# EAGLE schematic AS5040 (EAGLE 6.3)
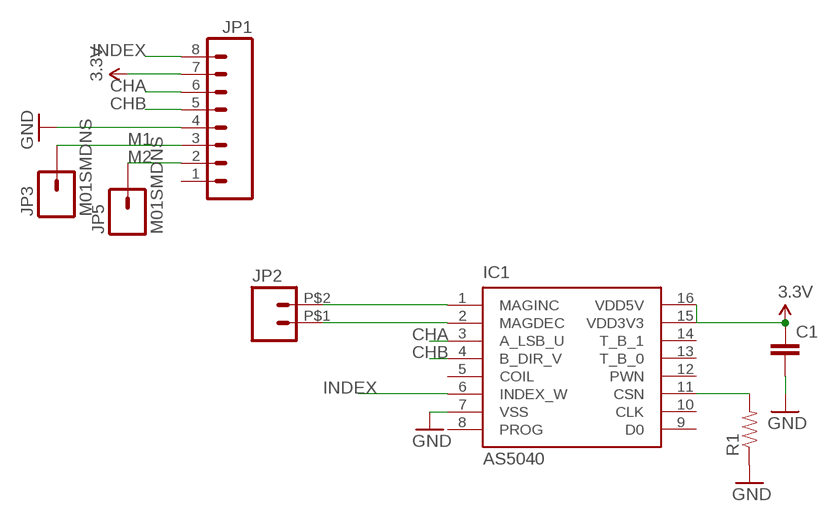
[diagram p0: schematic, sheet 1]

## Parts
C1  CAP0603-CAP  [0603-CAP]
IC1  AS5040  [SSOP16]
JP1  M08  [BM08B]
JP2  M02  [1X2SMD]
JP3  M01SMDNS  [1X01NS]
JP5  M01SMDNS  [1X01NS]
R1  RESISTOR0603-RES  [0603-RES]

## Nets
3.3V: C1.1 IC1.15(VDD3V3) IC1.16(VDD5V) JP1.7
CHA: IC1.3(A_LSB_U) JP1.6
CHB: IC1.4(B_DIR_V) JP1.5
GND: C1.2 IC1.7(VSS) JP1.4 R1.1
INDEX: IC1.6(INDEX_W) JP1.8
M1: JP1.3 JP3.1
M2: JP1.2 JP5.1
N$3: IC1.11(CSN) R1.2
N$4: IC1.1(MAGINC) JP2.P$2
N$5: IC1.2(MAGDEC) JP2.P$1
Unconnected: IC1.5(COIL) IC1.8(PROG) IC1.9(D0) IC1.10(CLK) IC1.12(PWN) IC1.13(T_B_0) IC1.14(T_B_1) JP1.1

## Library data of the parts
C1 = SparkFun-Passives:CAP: Capacitor Standard 0603 ceramic capacitor, and 0.1" leaded capacitor.
IC1 = austriamicrosystems:AS5040: 10-BIT PROGRAMMABLE MAGNETIC ROTARY ENCODER Source: www.austriamicrosystems.com .. AS5040DataSheetRev12.pdf; MPN: AS5040ASSU; OC_FARNELL: 1630800; OC_NEWARK: 59P4059
JP1 = SparkFun-Connectors:M08: Header 8 Standard 8-pin 0.1" header. Use with straight break away headers (SKU : PRT-00116), right angle break away headers (PRT-00553), swiss pins (PRT-00743), machine pins (PRT-00117), and female headers (PRT-00115).
JP2 = SparkFun-Connectors:M02: Header 2 Standard 2-pin 0.1" header. Use with straight break away headers (SKU : PRT-00116), right angle break away headers (PRT-00553), swiss pins (PRT-00743), machine pins (PRT-00117), and female headers (PRT-00115). Molex polarized connector foot print use with SKU : PRT-08233 with associated crimp pins and housings.
JP3 JP5 = SparkFun-Connectors:M01: Header 1 Standard 1-pin 0.1" header. Use with straight break away headers (SKU : PRT-00116), right angle break away headers (PRT-00553), swiss pins (PRT-00743), machine pins (PRT-00117), and female headers (PRT-00115).
R1 = SparkFun-Passives:RESISTOR: Resistor Basic schematic elements and footprints for 0603, 1206, and PTH resistors.